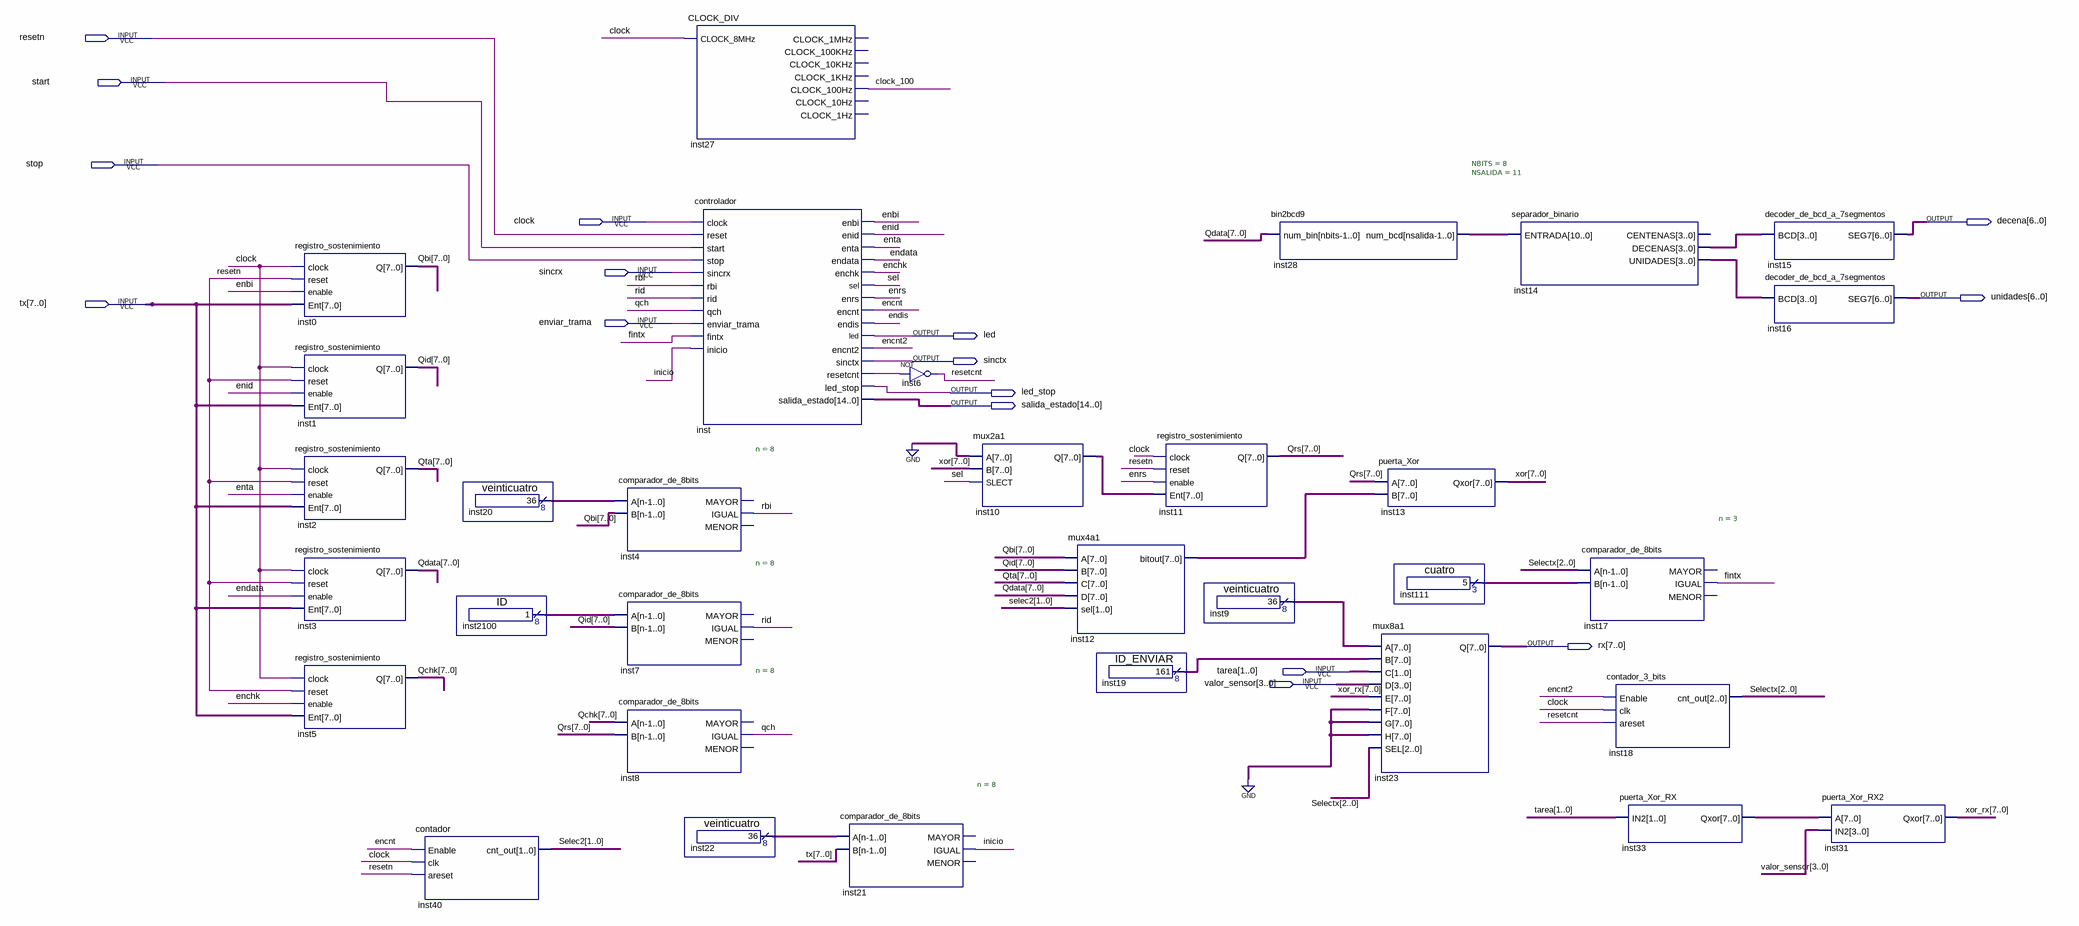
[diagram p0: schematic sheet]
// Quartus schematic Diagrama.bdf as structural Verilog: 32 symbols, 16 pins
module Diagrama (
  input  resetn,
  input  start,
  input  stop,
  input  clock,
  input  sincrx,
  input  [7:0] tx,
  input  enviar_trama,
  input  [1:0] tarea,
  input  [3:0] valor_sensor,
  output [6:0] decena,
  output [6:0] unidades,
  output led,
  output sinctx,
  output led_stop,
  output [14:0] salida_estado,
  output [7:0] rx
);

  wire clock_100, enbi, enchk, encnt, encnt2, endata, endis, enid, enrs, enta, fintx, inicio, inst_resetcnt,
       qch, rbi, resetcnt, rid, sel;
  wire [1:0] selec2;
  wire [2:0] inst111_result, Selectx;
  wire [3:0] inst14_decenas, inst14_unidades;
  wire [7:0] inst9_result, inst10_q, inst12_bitout, inst19_result, inst20_result, inst22_result, inst33_qxor,
       inst2100_result, Qbi, Qchk, Qdata, Qid, Qrs, Qta, \xor , xor_rx;
  wire [10:0] inst28_num_bcd;

  registro_sostenimiento inst0 (.clock(clock), .reset(resetn), .enable(enbi), .Ent(tx), .Q(Qbi));
  registro_sostenimiento inst1 (.clock(clock), .reset(resetn), .enable(enid), .Ent(tx), .Q(Qid));
  registro_sostenimiento inst2 (.clock(clock), .reset(resetn), .enable(enta), .Ent(tx), .Q(Qta));
  registro_sostenimiento inst3 (.clock(clock), .reset(resetn), .enable(endata), .Ent(tx), .Q(Qdata));
  registro_sostenimiento inst5 (.clock(clock), .reset(resetn), .enable(enchk), .Ent(tx), .Q(Qchk));
  contador inst40 (.Enable(encnt), .clk(clock), .areset(resetn), .cnt_out(selec2));
  veinticuatro inst20 (.result(inst20_result));
  ID inst2100 (.result(inst2100_result));
  comparador_de_8bits #(.n(8)) inst4 (.A(inst20_result), .B(Qbi), .IGUAL(rbi));  // open: MAYOR, MENOR
  comparador_de_8bits #(.n(8)) inst7 (.A(inst2100_result), .B(Qid), .IGUAL(rid));  // open: MAYOR, MENOR
  comparador_de_8bits #(.n(8)) inst8 (.A(Qchk), .B(Qrs), .IGUAL(qch));  // open: MAYOR, MENOR
  CLOCK_DIV inst27 (
    .CLOCK_8MHz(clock), .CLOCK_100Hz(clock_100));  // open: CLOCK_1MHz, CLOCK_100KHz, CLOCK_10KHz, CLOCK_1KHz, CLOCK_10Hz, CLOCK_1Hz
  controlador inst (
    .clock(clock), .reset(resetn), .start(start), .stop(stop), .sincrx(sincrx), .rbi(rbi), .rid(rid),
    .qch(qch), .enviar_trama(enviar_trama), .fintx(fintx), .inicio(inicio), .enbi(enbi), .enid(enid),
    .enta(enta), .endata(endata), .enchk(enchk), .sel(sel), .enrs(enrs), .encnt(encnt), .endis(endis),
    .led(led), .encnt2(encnt2), .sinctx(sinctx), .resetcnt(inst_resetcnt), .led_stop(led_stop),
    .salida_estado(salida_estado));
  veinticuatro inst22 (.result(inst22_result));
  comparador_de_8bits #(.n(8)) inst21 (.A(inst22_result), .B(tx), .IGUAL(inicio));  // open: MAYOR, MENOR
  not inst6 (resetcnt, inst_resetcnt);
  mux2a1 inst10 (.A({8{1'b0}}), .B(\xor ), .SLECT(sel), .Q(inst10_q));
  mux4a1 inst12 (.A(Qbi), .B(Qid), .C(Qta), .D(Qdata), .sel(selec2), .bitout(inst12_bitout));
  ID_ENVIAR inst19 (.result(inst19_result));
  registro_sostenimiento inst11 (.clock(clock), .reset(resetn), .enable(enrs), .Ent(inst10_q), .Q(Qrs));
  veinticuatro inst9 (.result(inst9_result));
  bin2bcd9 #(.NBITS(8), .NSALIDA(11)) inst28 (.num_bin(Qdata), .num_bcd(inst28_num_bcd));
  puerta_Xor inst13 (.A(Qrs), .B(inst12_bitout), .Qxor(\xor ));
  cuatro inst111 (.result(inst111_result));
  mux8a1 inst23 (
    .A(inst9_result), .B(inst19_result), .C(tarea), .D(valor_sensor), .E(xor_rx), .F({8{1'b0}}),
    .G({8{1'b0}}), .H({8{1'b0}}), .SEL(Selectx), .Q(rx));
  separador_binario inst14 (
    .ENTRADA(inst28_num_bcd), .DECENAS(inst14_decenas), .UNIDADES(inst14_unidades));  // open: CENTENAS
  comparador_de_8bits #(.n(3)) inst17 (.A(Selectx), .B(inst111_result), .IGUAL(fintx));  // open: MAYOR, MENOR
  contador_3_bits inst18 (.Enable(encnt2), .clk(clock), .areset(resetcnt), .cnt_out(Selectx));
  puerta_Xor_RX inst33 (.IN2(tarea), .Qxor(inst33_qxor));
  decoder_de_bcd_a_7segmentos inst15 (.BCD(inst14_decenas), .SEG7(decena));
  decoder_de_bcd_a_7segmentos inst16 (.BCD(inst14_unidades), .SEG7(unidades));
  puerta_Xor_RX2 inst31 (.A(inst33_qxor), .IN2(valor_sensor), .Qxor(xor_rx));
endmodule
